# EAGLE schematic magnetorquer_extension_board_f1 (EAGLE 8.4.2)
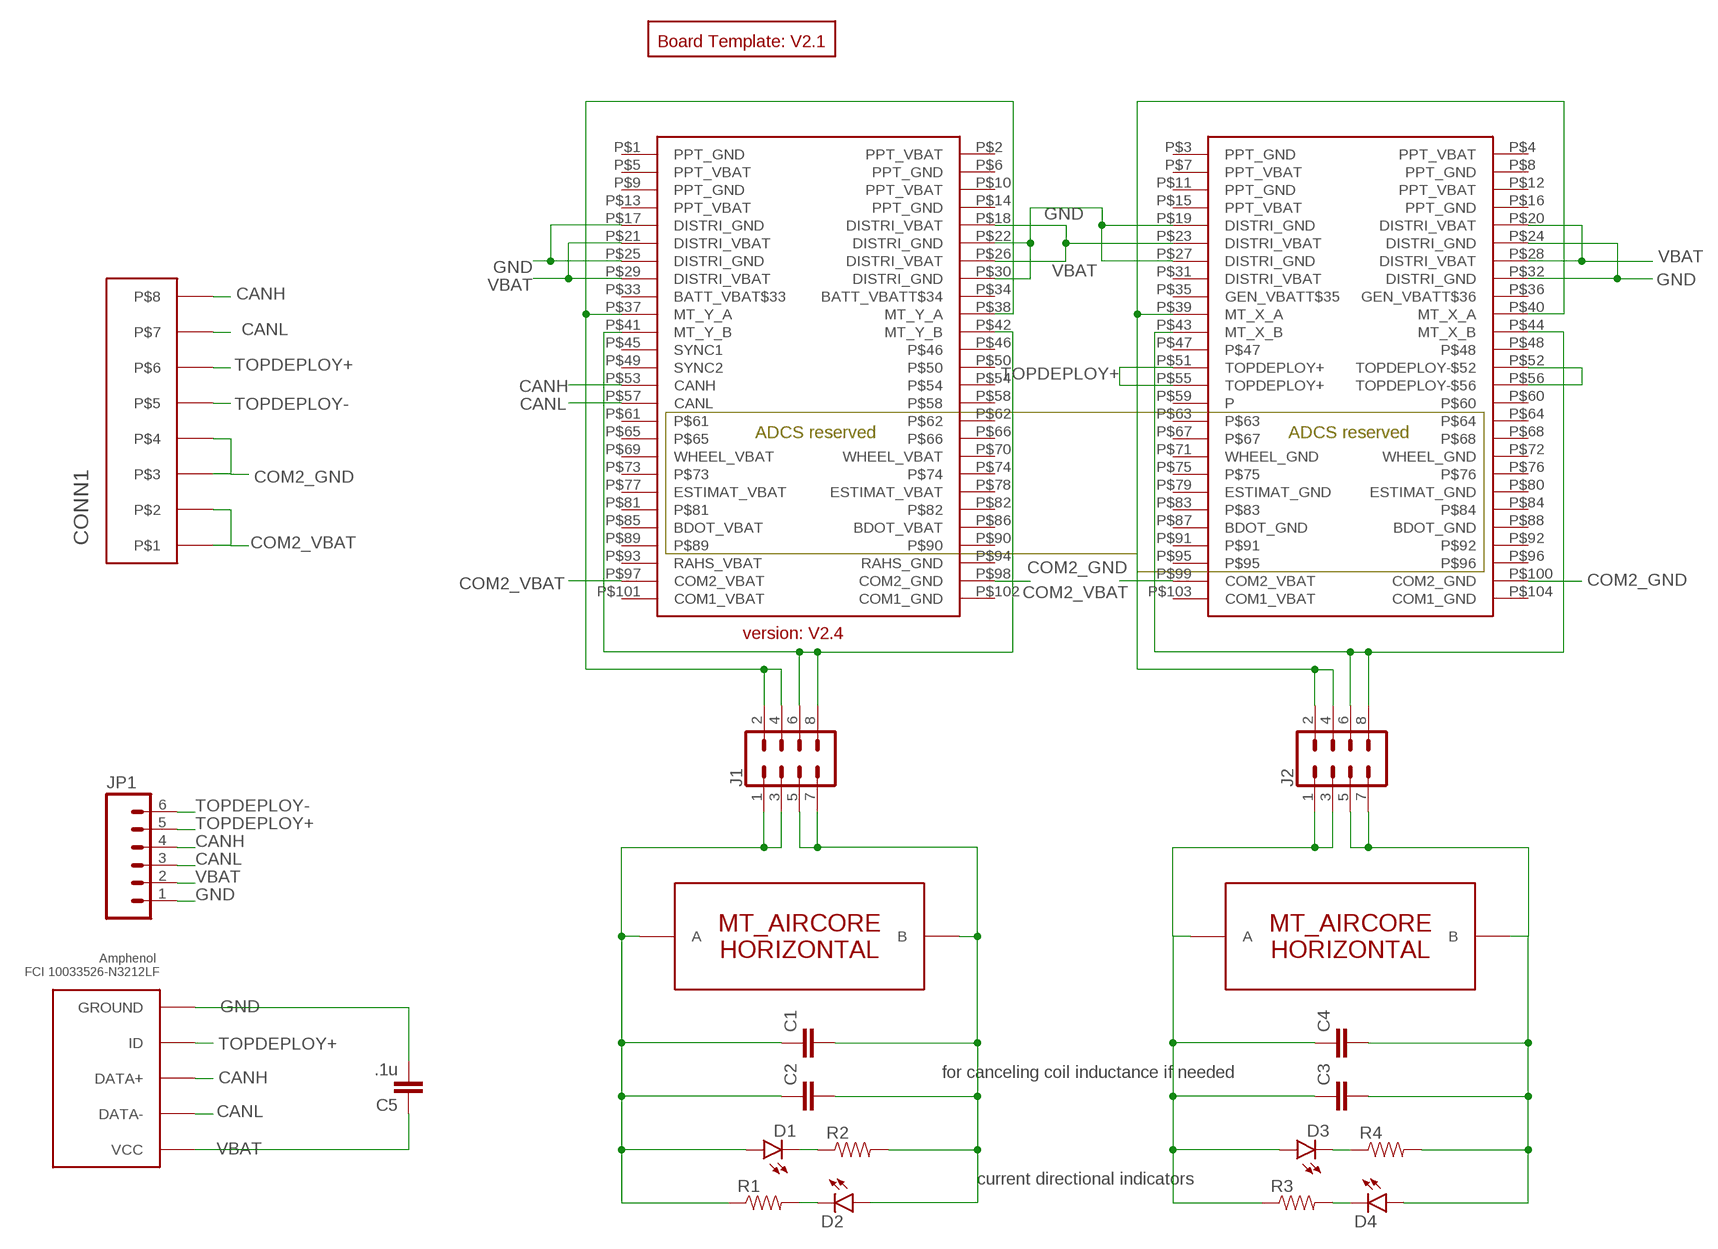
[diagram p0: schematic, sheet 1]

## Parts
C1  CAPACITOR0805  [0805]
C2  CAPACITOR1210  [1210]
C3  CAPACITOR1210  [1210]
C4  CAPACITOR0805  [0805]
C5  .1u  CAPACITOR0805  [0805]
CONN1  PICOLOCK_8PICOLOCK_8  [PICOLOCK_8]
D1  LED  [LED-1206]
D2  LED  [LED-1206]
D3  LED  [LED-1206]
D4  LED  [LED-1206]
J1  CONN_04X2  [2X4]
J2  CONN_04X2  [2X4]
JP1  M06LOCK  [1X06_LOCK]
MT_X  MT_AIRCORE_HORIZONTAL  [MT_AIRCORE_HORIZONTAL]
MT_Y  MT_AIRCORE_HORIZONTAL  [MT_AIRCORE_HORIZONTAL]
R1  RESISTOR0805  [0805]
R2  RESISTOR0805  [0805]
R3  RESISTOR0805  [0805]
R4  RESISTOR0805  [0805]
U$1  PC104_CONNECTOR  [PC104_CONNECTOR]
U$2  BOARD_TEMPLATESERCURED  [BOARD_TEMPLATE_SECURED]
U$3  USB_MINI-B_AMPHENOL  [USB_MINI_B]

## Nets
CANH: CONN1.P$8 JP1.4 U$1.P$53(CANH) U$3.DATA+
CANL: CONN1.P$7 JP1.3 U$1.P$57(CANL) U$3.DATA-
COM2_GND: CONN1.P$3 CONN1.P$4 U$1.P$98(COM2_GND) U$1.P$100(COM2_GND)
COM2_VBAT: CONN1.P$1 CONN1.P$2 U$1.P$97(COM2_VBAT) U$1.P$99(COM2_VBAT)
GND: C5.2 JP1.1 U$1.P$17(DISTRI_GND) U$1.P$19(DISTRI_GND) U$1.P$22(DISTRI_GND) U$1.P$24(DISTRI_GND) U$1.P$25(DISTRI_GND) U$1.P$27(DISTRI_GND) U$1.P$30(DISTRI_GND) U$1.P$32(DISTRI_GND) U$3.GND1(GROUND) U$3.GND2(GROUND) U$3.GND3(GROUND) U$3.GND4(GROUND) U$3.GROUND
MT_X_A: C3.1 C4.1 D3.A J2.1 J2.3 MT_Y.A R3.1
MT_X_A_STACK: J2.2 J2.4 U$1.P$39(MT_X_A) U$1.P$40(MT_X_A)
MT_X_B: C3.2 C4.2 D4.A J2.5 J2.7 MT_Y.B R4.2
MT_X_B_STACK: J2.6 J2.8 U$1.P$43(MT_X_B) U$1.P$44(MT_X_B)
MT_Y_A: C1.1 C2.1 D1.A J1.1 J1.3 MT_X.A R1.1
MT_Y_A_STACK: J1.2 J1.4 U$1.P$37(MT_Y_A) U$1.P$38(MT_Y_A)
MT_Y_B: C1.2 C2.2 D2.A J1.5 J1.7 MT_X.B R2.2
MT_Y_B_STACK: J1.6 J1.8 U$1.P$41(MT_Y_B) U$1.P$42(MT_Y_B)
N$2: D1.C R2.1
N$3: D2.C R1.2
N$4: D3.C R4.1
N$5: D4.C R3.2
TOPDEPLOY+: CONN1.P$6 JP1.5 U$1.P$51(TOPDEPLOY+) U$1.P$55(TOPDEPLOY+) U$3.ID
TOPDEPLOY-: CONN1.P$5 JP1.6 U$1.P$52(TOPDEPLOY-$52) U$1.P$56(TOPDEPLOY-$56)
VBAT: C5.1 JP1.2 U$1.P$18(DISTRI_VBAT) U$1.P$20(DISTRI_VBAT) U$1.P$21(DISTRI_VBAT) U$1.P$23(DISTRI_VBAT) U$1.P$26(DISTRI_VBAT) U$1.P$28(DISTRI_VBAT) U$1.P$29(DISTRI_VBAT) U$3.VCC
Unconnected: U$1.P$1(PPT_GND) U$1.P$2(PPT_VBAT) U$1.P$3(PPT_GND) U$1.P$4(PPT_VBAT) U$1.P$5(PPT_VBAT) U$1.P$6(PPT_GND) U$1.P$7(PPT_VBAT) U$1.P$8(PPT_GND) U$1.P$9(PPT_GND) U$1.P$10(PPT_VBAT) U$1.P$11(PPT_GND) U$1.P$12(PPT_VBAT) U$1.P$13(PPT_VBAT) U$1.P$14(PPT_GND) U$1.P$15(PPT_VBAT) U$1.P$16(PPT_GND) U$1.P$31(DISTRI_VBAT) U$1.P$33(BATT_VBAT$33) U$1.P$34(BATT_VBATT$34) U$1.P$35(GEN_VBATT$35) U$1.P$36(GEN_VBATT$36) U$1.P$45(SYNC1) U$1.P$46 U$1.P$47 U$1.P$48 U$1.P$49(SYNC2) U$1.P$50 U$1.P$54 U$1.P$58 U$1.P$59(P) U$1.P$60 U$1.P$61 U$1.P$62 U$1.P$63 U$1.P$64 U$1.P$65 U$1.P$66 U$1.P$67 U$1.P$68 U$1.P$69(WHEEL_VBAT) U$1.P$70(WHEEL_VBAT) U$1.P$71(WHEEL_GND) U$1.P$72(WHEEL_GND) U$1.P$73 U$1.P$74 U$1.P$75 U$1.P$76 U$1.P$77(ESTIMAT_VBAT) U$1.P$78(ESTIMAT_VBAT) U$1.P$79(ESTIMAT_GND) U$1.P$80(ESTIMAT_GND) U$1.P$81 U$1.P$82 U$1.P$83 U$1.P$84 U$1.P$85(BDOT_VBAT) U$1.P$86(BDOT_VBAT) U$1.P$87(BDOT_GND) U$1.P$88(BDOT_GND) U$1.P$89 U$1.P$90 U$1.P$91 U$1.P$92 U$1.P$93(RAHS_VBAT) U$1.P$94(RAHS_GND) U$1.P$95 U$1.P$96 U$1.P$101(COM1_VBAT) U$1.P$102(COM1_GND) U$1.P$103(COM1_VBAT) U$1.P$104(COM1_GND)

## Notes on the sheet
- for canceling coil inductance if needed
- current directional indicators

## Library data of the parts
C1-C5 = DubSat1 Components:CAPACITOR: Capacitor Standard 0603 ceramic capacitor, and 0.1" leaded capacitor.
CONN1 = DubSat1 Components:PICOLOCK_8
D1-D4 = DubSat1 Components:LED
J1 J2 = SparkFun-Connectors:CONN_04X2: Multi connection point. Often used as Generic Header-pin footprint for 0.1 inch spaced/style header connections On any of the 0.1 inch spaced packages, you can populate with these: Break Away Headers - Straight <https://www.sparkfun.com/products/116> (PRT-00116) Break Away Male Headers - Right Angle <https://www.sparkfun.com/products/553> (PRT-00553) Female Headers <https://www.sparkfun.com/products/115> (PRT-00115) Break Away Headers - Machine Pin <https://www.sparkfun.com/products/117> (PRT-00117) Break Away Female Headers - Swiss Machine Pin <https://www.sparkfun.com/products/743> (PRT-00743)
JP1 = SparkFun-Connectors:M06: Header 6 Standard 6-pin 0.1" header. Use with straight break away headers (SKU : PRT-00116), right angle break away headers (PRT-00553), swiss pins (PRT-00743), machine pins (PRT-00117), and female headers (PRT-00115). Molex polarized connector foot print use with SKU : PRT-08094 with associated crimp pins and housings. NOTES ON THE VARIANTS LOCK and LOCK_LONGPADS... This footprint was designed to help hold the alignment of a through-hole component (i.e. 6-pin header) while soldering it into place. You may notice that each hole has been shifted either up or down by 0.005 of an inch from it's more standard position (which is a perfectly straight line). This slight alteration caused the pins (the squares in the middle) to touch the edges of the holes. Because they are alternating, it causes a "brace" to hold the component in place. 0.005 has proven to be the perfect amount of "off-center" position when using our standard breakaway headers. Although looks a little odd when you look at the bare footprint, once you have a header in there, the alteration is very hard to notice. Also,if you push a header all the way into place, it is covered up entirely on the bottom side. This idea of altering the position of holes to aid alignment will be further integrated into the Sparkfun Library for other footprints. It can help hold any component with 3 or more connection pins.
MT_X MT_Y = DubSat1 Components:MT_AIRCORE_HORIZONTAL
R1-R4 = DubSat1 Components:RESISTOR: Resistor Basic schematic elements and footprints for 0603, 1206, and PTH resistors.
U$1 = DubSat1 Components:PC104_CONNECTOR
U$2 = DubSat1 Components:BOARD_TEMPLATE
U$3 = I_O_connectors:USB_MINI-B_AMPHENOL